# Altium schematic sheet MCU.SchDoc
size A4
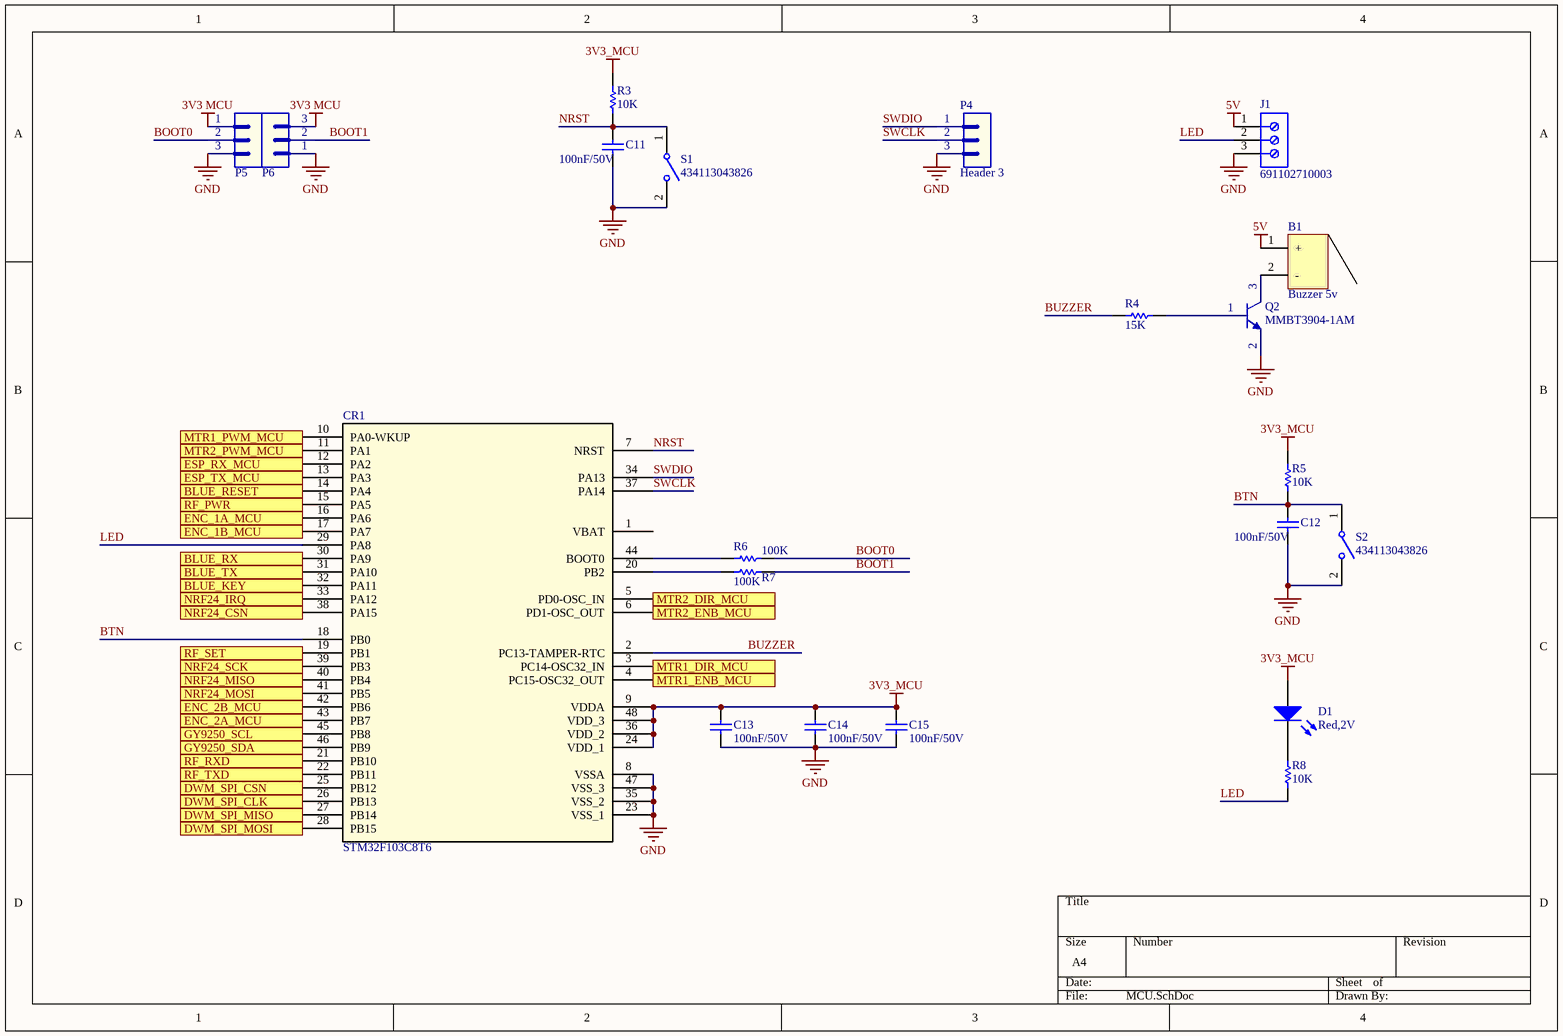
[diagram p0: MCU.SchDoc]

## Parts
B1  Buzzer 5v  [Buzzer 5v]
C11  value 100nF/50V  [CAP-SM-0805]  (hidden comment: Cap-1nF-50V-0805)
C12  value 100nF/50V  [CAP-SM-0805]  (hidden comment: Cap-1nF-50V-0805)
C13  value 100nF/50V  [CAP-SM-0805]  (hidden comment: Cap-1nF-50V-0805)
C14  value 100nF/50V  [CAP-SM-0805]  (hidden comment: Cap-1nF-50V-0805)
C15  value 100nF/50V  [CAP-SM-0805]  (hidden comment: Cap-1nF-50V-0805)
CR1  STM32F103C8T6  [STM32F103C8T6]
D1  value Red,2V  [LED-3mm]  (hidden comment: LED-RED-TH-3mm)
J1  691102710003  [691102710003]
P4  Header 3  [jp3]
P5  (no value)  [jp3]
P6  (no value)  [jp3]
Q2  MMBT3904-1AM  [SOT23_NEX]
R3  value 10K  [RES-SM-0805]  (hidden comment: Res-0-0805)
R4  value 15K  [RES-SM-0805]  (hidden comment: Res-12K-0805)
R5  value 10K  [RES-SM-0805]  (hidden comment: Res-0-0805)
R6  value 100K  [RES-SM-0805]  (hidden comment: Res-1K-0805)
R7  value 100K  [RES-SM-0805]  (hidden comment: Res-1K-0805)
R8  value 10K  [RES-SM-0805]  (hidden comment: Res-0-0805)
S1  434113043826  [434113043826]
S2  434113043826  [434113043826]

## Ports
BLUE_KEY (out), BLUE_RESET (out), BLUE_RX (out), BLUE_TX (in), DWM_SPI_CLK (out), DWM_SPI_CSN (out), DWM_SPI_MISO (in), DWM_SPI_MOSI (out), ENC_1A_MCU (in), ENC_1B_MCU (in), ENC_2A_MCU (in), ENC_2B_MCU (in), ESP_RX_MCU (out), ESP_TX_MCU (in), GY9250_SCL (out), GY9250_SDA (out), MTR1_DIR_MCU (out), MTR1_ENB_MCU (out), MTR1_PWM_MCU (out), MTR2_DIR_MCU (out), MTR2_ENB_MCU (out), MTR2_PWM_MCU (out), NRF24_CSN (out), NRF24_IRQ (in), NRF24_MISO (in), NRF24_MOSI (out), NRF24_SCK (out), RF_PWR (out), RF_RXD (out), RF_SET (out), RF_TXD (in)

## Nets
3V3 MCU: P5.1 P6.3
3V3_MCU: C13.2 C14.2 C15.2 CR1.9(VDDA) CR1.24(VDD_1) CR1.36(VDD_2) CR1.48(VDD_3) D1.1(A) R3.2 R5.2
5V: B1.1(+) J1.1
GND: C11.1 C12.1 C13.1 C14.1 C15.1 CR1.8(VSSA) CR1.23(VSS_1) CR1.35(VSS_2) CR1.47(VSS_3) J1.3 P4.3 P5.3 P6.1 Q2.2(E) S1.2 S2.2
BLUE_KEY: CR1.32(PA11) ; port BLUE_KEY
BLUE_RESET: CR1.14(PA4) ; port BLUE_RESET
BLUE_RX: CR1.30(PA9) ; port BLUE_RX
BLUE_TX: CR1.31(PA10) ; port BLUE_TX
BOOT0: P5.2 R6.2
BOOT1: P6.2 R7.2
BTN: C12.2 CR1.18(PB0) R5.1 S2.1
BUZZER: CR1.2(PC13-TAMPER-RTC) R4.1
DWM_SPI_CLK: CR1.26(PB13) ; port DWM_SPI_CLK
DWM_SPI_CSN: CR1.25(PB12) ; port DWM_SPI_CSN
DWM_SPI_MISO: CR1.27(PB14) ; port DWM_SPI_MISO
DWM_SPI_MOSI: CR1.28(PB15) ; port DWM_SPI_MOSI
ENC_1A_MCU: CR1.16(PA6) ; port ENC_1A_MCU
ENC_1B_MCU: CR1.17(PA7) ; port ENC_1B_MCU
ENC_2A_MCU: CR1.43(PB7) ; port ENC_2A_MCU
ENC_2B_MCU: CR1.42(PB6) ; port ENC_2B_MCU
ESP_RX_MCU: CR1.12(PA2) ; port ESP_RX_MCU
ESP_TX_MCU: CR1.13(PA3) ; port ESP_TX_MCU
GY9250_SCL: CR1.45(PB8) ; port GY9250_SCL
GY9250_SDA: CR1.46(PB9) ; port GY9250_SDA
LED: CR1.29(PA8) J1.2 R8.1
MTR1_DIR_MCU: CR1.3(PC14-OSC32_IN) ; port MTR1_DIR_MCU
MTR1_ENB_MCU: CR1.4(PC15-OSC32_OUT) ; port MTR1_ENB_MCU
MTR1_PWM_MCU: CR1.10(PA0-WKUP) ; port MTR1_PWM_MCU
MTR2_DIR_MCU: CR1.5(PD0-OSC_IN) ; port MTR2_DIR_MCU
MTR2_ENB_MCU: CR1.6(PD1-OSC_OUT) ; port MTR2_ENB_MCU
MTR2_PWM_MCU: CR1.11(PA1) ; port MTR2_PWM_MCU
NRF24_CSN: CR1.38(PA15) ; port NRF24_CSN
NRF24_IRQ: CR1.33(PA12) ; port NRF24_IRQ
NRF24_MISO: CR1.40(PB4) ; port NRF24_MISO
NRF24_MOSI: CR1.41(PB5) ; port NRF24_MOSI
NRF24_SCK: CR1.39(PB3) ; port NRF24_SCK
NRST: C11.2 CR1.7(NRST) R3.1 S1.1
RF_PWR: CR1.15(PA5) ; port RF_PWR
RF_RXD: CR1.21(PB10) ; port RF_RXD
RF_SET: CR1.19(PB1) ; port RF_SET
RF_TXD: CR1.22(PB11) ; port RF_TXD
SWCLK: CR1.37(PA14) P4.2
SWDIO: CR1.34(PA13) P4.1
NetB1_2: B1.2(-) Q2.3(C)
NetCR1_20: CR1.20(PB2) R7.1
NetCR1_44: CR1.44(BOOT0) R6.1
NetD1_2: D1.2(K) R8.2
NetQ2_1: Q2.1(B) R4.2

Not connected (* = marked no-connect by the designer): CR1 1(VBAT)

## Library data of the parts
C11-C15 = Cap-1nF-50V-0805: CAP CER 1000PF 100V X7R 0805; Manufacturer: Johanson Dielectrics Inc.; Manufacturer Part Number: 101X15W102MV4E; Local Supplier: thegioiic; Local Supplier Link: https://thegioiic.com/products/tu-1nf-50v-0805; Supplier 1: Digikey; Supplier 1 Link: https://www.digikey.com/product-detail/en/johanson-dielectrics-inc/101X15W102MV4E/709-1335-1-ND/2327235; Supplier 1 Part Number: 709-1335-1-ND
CR1 = STM32F103C8T6: SourceLibrary: StMicro_2011-06-07; Built_By: EMA_UL_Team; Vendor: STMicroelectronics; Type: DEV; Manufacturer_Part_Number: STM32F103C8T6; Copyright: Copyright (C) 2018 Accelerated Designs. All rights reserved; RefDes: RefDes
D1 = LED-RED-TH-3mm: LED RED CLEAR T-1 T/H; Manufacturer: Kingbright; Manufacturer Part Number: WP710A10SEC/J3; Local Supplier: thegioiic; Local Supplier Link: https://thegioiic.com/products/led-do-3mm-chan-dai; Supplier 1: Digikey; Supplier 1 Link: https://www.digikey.com/product-detail/en/kingbright/WP710A10SEC-J3/754-1589-ND/2769815; Supplier 1 Part Number: 754-1589-ND
J1 = 691102710003: WR-TBL Serie 102 Horizontal Entry Modular, Pressure Clamp, pitch 5mm, 3p; Compliance: Lead free / RoHS; Modularity: Yes; PCB/Cable/Panel: PCB; Pin Number: 3; Rated Current [UL]: 15A; Working Voltage [UL]: 250VAC; ComponentLink1Description: Manufacturer; ComponentLink1URL: http://www.we-online.de; ComponentLink2URL: https://katalog.we-online.de/em/datasheet/691102710003.pdf; ComponentLink2Description: Datasheet; Mounting Technology: THT; Part Number: 691102710003; Packaging: Box; Operating Temperature: -40 to +105degC; Pitch: 5mm; Published Date: October 2019; Type: Horizontal; Publisher: Wurth Elektronik; Application: Pressure Clamp
P4-P6 = Header 3: Header, 3-Pin; LatestRevisionDate: 17-Jul-2002; LatestRevisionNote: Re-released for DXP Platform.; Publisher: Altium Limited
R3 R5 R8 = Res-0-0805: RES 0 OHM JUMPER 0805; Manufacturer: Vishay Dale; Manufacturer Part Number: WSL080500000ZEA9; Local Supplier: thegioiic; Local Supplier Link: https://thegioiic.com/products/dien-tro-0-ohm-0805-5; Supplier 1: Digikey; Supplier 1 Link: https://www.digikey.com/product-detail/en/vishay-dale/WSL080500000ZEA9/541-3928-1-ND/7423223; Supplier 1 Part Number: 541-3928-1-ND
R4 = Res-12K-0805: RES 12 KOHM JUMPER 0805; Manufacturer: Vishay Thin Film; Manufacturer Part Number: PAT0805E3121BST1; Local Supplier: icdayroi; Local Supplier Link: https://icdayroi.com/dien-tro-12k-0805-1-goi-50-con; Supplier 1: Digikey; Supplier 1 Link: https://www.digikey.com/product-detail/en/vishay-thin-film/PAT0805E3121BST1/PAT0805E3121BST1-ND/2281536; Supplier 1 Part Number: PAT0805E3121BST1-ND
R6 R7 = Res-1K-0805: RES 1K OHM 1% 1/4W 0805; Manufacturer: Stackpole Electronics Inc; Manufacturer Part Number: RNCP0805FTD1K00; Local Supplier: thegioiic; Local Supplier Link: https://thegioiic.com/products/dien-tro-1k-ohm-0805-5; Supplier 1: Digikey; Supplier 1 Link: https://www.digikey.com/product-detail/en/stackpole-electronics-inc/RNCP0805FTD1K00/RNCP0805FTD1K00CT-ND/2240568; Supplier 1 Part Number: RNCP0805FTD1K00CT-ND
S1 S2 = 434113043826: WS-TASV J-Bend SMT Tact Switch 6x3.5mm, height 4.3mm, 260gf; Rated Voltage: 12VDC; Rated Current: 50mA; Washable: No; ComponentLink1Description: Manufacturer; ComponentLink1URL: http://www.we-online.de; ComponentLink2Description: Datasheet; ComponentLink2URL: https://katalog.we-online.com/em/datasheet/434113043826.pdf; Operating Temperature: -40 to +85degC; Part Number: 434113043826; Published Date: September 2019; Contact Material: Stainless Steel; Height: 4.3mm; Mounting Technology: SMT; Contact Plating: Silver; Operation Force: 260gf; Packaging: Tape and Reel; Terminal Material: Copper Alloy; Publisher: Wurth Elektronik; Terminal Plating: Silver